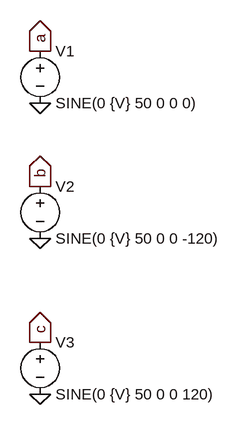
[diagram p0: schematic ac3phase.asc]
ac3phase.asc, the LTspice schematic file:
Version 4
SHEET 1 880 680
FLAG 96 640 0
FLAG 96 400 0
FLAG 96 192 0
FLAG 96 112 a
IOPIN 96 112 Out
FLAG 96 560 c
IOPIN 96 560 Out
FLAG 96 320 b
IOPIN 96 320 Out
SYMBOL voltage 96 96 R0
WINDOW 123 0 0 Left 0
WINDOW 39 0 0 Left 0
SYMATTR InstName V1
SYMATTR Value SINE(0 {V} 50 0 0 0)
SYMBOL voltage 96 304 R0
WINDOW 123 0 0 Left 0
WINDOW 39 0 0 Left 0
SYMATTR InstName V2
SYMATTR Value SINE(0 {V} 50 0 0 -120)
SYMBOL voltage 96 544 R0
WINDOW 123 0 0 Left 0
WINDOW 39 0 0 Left 0
SYMATTR InstName V3
SYMATTR Value SINE(0 {V} 50 0 0 120)

The netlist it stands for:
* ac3phase.asc
V1 a 0 SINE(0 {V} 50 0 0 0)
V2 b 0 SINE(0 {V} 50 0 0 -120)
V3 c 0 SINE(0 {V} 50 0 0 120)
.backanno
.end